# Altium schematic sheet Buzzer.SchDoc
size A4
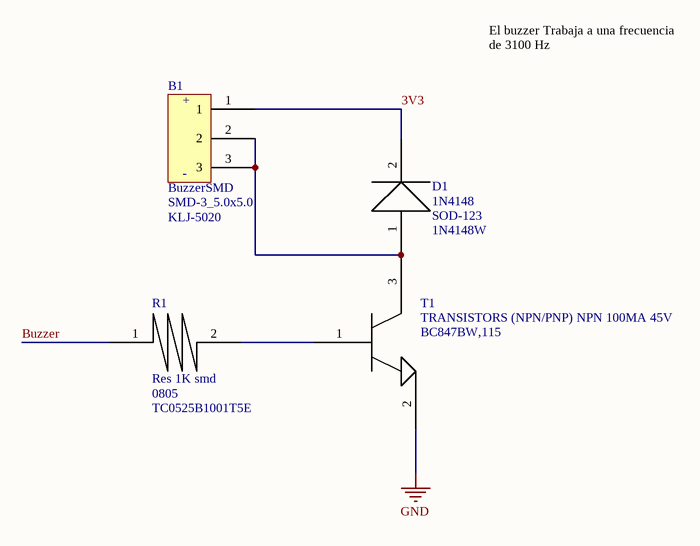
[diagram p0: Buzzer.SchDoc]

## Parts
B1  BuzzerSMD  Package: SMD-3_5.0x5.0  MFR.Part #: KLJ-5020  [BUZZERSMD]
D1  1N4148  Package: SOD-123  MFR.Part #: 1N4148W  [1N4148]
R1  Res 1K smd  Package: 0805  MFR.Part #: TC0525B1001T5E  [RES 1K]
T1  TRANSISTORS (NPN/PNP) NPN 100MA 45V  Supplier Number Part: BC847BW,115  [C8659]

## Nets
GND: T1.2
3V3: B1.1 D1.2
Buzzer: R1.1
NetB1_2: B1.2 B1.3 D1.1 T1.3
NetR1_2: R1.2 T1.1

## Notes on the sheet
- El buzzer Trabaja a una frecuencia de 3100 Hz
- (in symbol BuzzerSMD) +; -

## Library data of the parts
T1 = C8659: TRANSISTORS (NPN/PNP) NPN 100MA 45V SOT-323(SC-70) ROHS; Package Part: SOT-323-3